# Altium project ALTAIR.PrjPcb (part 2 of 2)

## Sheet HDMI Termination.SchDoc
size A3; SheetNumber: 9; SheetTotal: 11
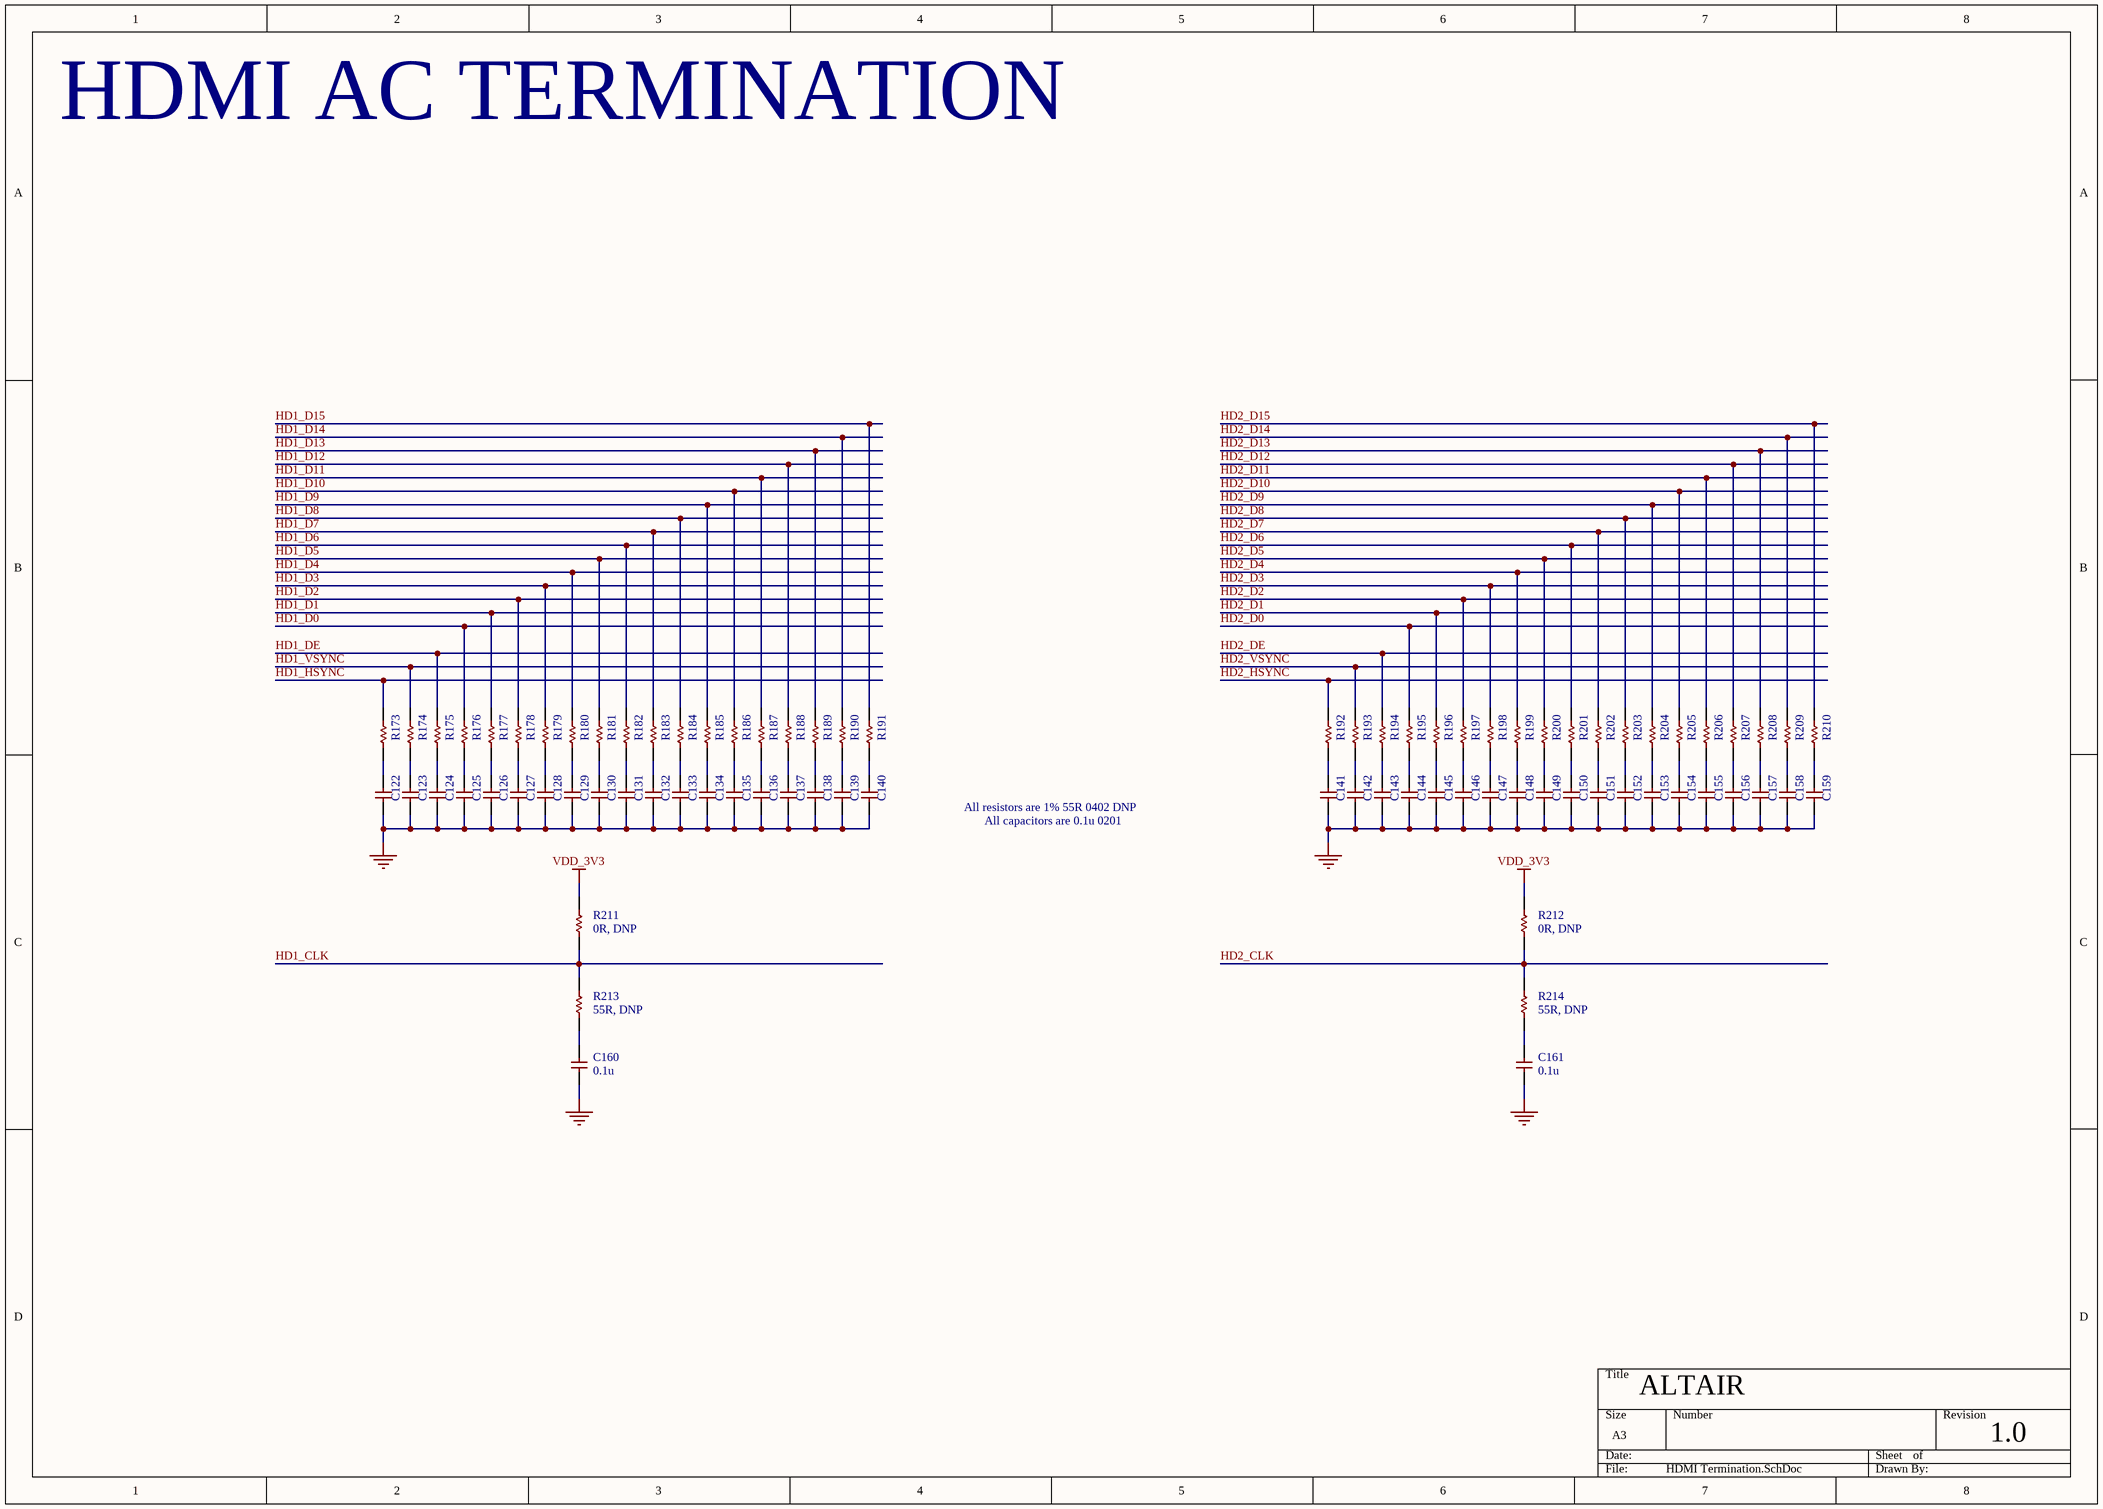
[diagram p8: HDMI Termination.SchDoc]

### Parts
C122  0.1u  [CAP_0201]  (value not drawn)
C123  0.1u  [CAP_0201]  (value not drawn)
C124  0.1u  [CAP_0201]  (value not drawn)
C125  0.1u  [CAP_0201]  (value not drawn)
C126  0.1u  [CAP_0201]  (value not drawn)
C127  0.1u  [CAP_0201]  (value not drawn)
C128  0.1u  [CAP_0201]  (value not drawn)
C129  0.1u  [CAP_0201]  (value not drawn)
C130  0.1u  [CAP_0201]  (value not drawn)
C131  0.1u  [CAP_0201]  (value not drawn)
C132  0.1u  [CAP_0201]  (value not drawn)
C133  0.1u  [CAP_0201]  (value not drawn)
C134  0.1u  [CAP_0201]  (value not drawn)
C135  0.1u  [CAP_0201]  (value not drawn)
C136  0.1u  [CAP_0201]  (value not drawn)
C137  0.1u  [CAP_0201]  (value not drawn)
C138  0.1u  [CAP_0201]  (value not drawn)
C139  0.1u  [CAP_0201]  (value not drawn)
C140  0.1u  [CAP_0201]  (value not drawn)
C141  0.1u  [CAP_0201]  (value not drawn)
C142  0.1u  [CAP_0201]  (value not drawn)
C143  0.1u  [CAP_0201]  (value not drawn)
C144  0.1u  [CAP_0201]  (value not drawn)
C145  0.1u  [CAP_0201]  (value not drawn)
C146  0.1u  [CAP_0201]  (value not drawn)
C147  0.1u  [CAP_0201]  (value not drawn)
C148  0.1u  [CAP_0201]  (value not drawn)
C149  0.1u  [CAP_0201]  (value not drawn)
C150  0.1u  [CAP_0201]  (value not drawn)
C151  0.1u  [CAP_0201]  (value not drawn)
C152  0.1u  [CAP_0201]  (value not drawn)
C153  0.1u  [CAP_0201]  (value not drawn)
C154  0.1u  [CAP_0201]  (value not drawn)
C155  0.1u  [CAP_0201]  (value not drawn)
C156  0.1u  [CAP_0201]  (value not drawn)
C157  0.1u  [CAP_0201]  (value not drawn)
C158  0.1u  [CAP_0201]  (value not drawn)
C159  0.1u  [CAP_0201]  (value not drawn)
C160  0.1u  [CAP_0201]
C161  0.1u  [CAP_0201]
R173  0R, DNP  [RES_0402]  (value not drawn)
R174  0R, DNP  [RES_0402]  (value not drawn)
R175  0R, DNP  [RES_0402]  (value not drawn)
R176  0R, DNP  [RES_0402]  (value not drawn)
R177  0R, DNP  [RES_0402]  (value not drawn)
R178  0R, DNP  [RES_0402]  (value not drawn)
R179  0R, DNP  [RES_0402]  (value not drawn)
R180  0R, DNP  [RES_0402]  (value not drawn)
R181  0R, DNP  [RES_0402]  (value not drawn)
R182  0R, DNP  [RES_0402]  (value not drawn)
R183  0R, DNP  [RES_0402]  (value not drawn)
R184  0R, DNP  [RES_0402]  (value not drawn)
R185  0R, DNP  [RES_0402]  (value not drawn)
R186  0R, DNP  [RES_0402]  (value not drawn)
R187  0R, DNP  [RES_0402]  (value not drawn)
R188  0R, DNP  [RES_0402]  (value not drawn)
R189  0R, DNP  [RES_0402]  (value not drawn)
R190  0R, DNP  [RES_0402]  (value not drawn)
R191  0R, DNP  [RES_0402]  (value not drawn)
R192  0R, DNP  [RES_0402]  (value not drawn)
R193  0R, DNP  [RES_0402]  (value not drawn)
R194  0R, DNP  [RES_0402]  (value not drawn)
R195  0R, DNP  [RES_0402]  (value not drawn)
R196  0R, DNP  [RES_0402]  (value not drawn)
R197  0R, DNP  [RES_0402]  (value not drawn)
R198  0R, DNP  [RES_0402]  (value not drawn)
R199  0R, DNP  [RES_0402]  (value not drawn)
R200  0R, DNP  [RES_0402]  (value not drawn)
R201  0R, DNP  [RES_0402]  (value not drawn)
R202  0R, DNP  [RES_0402]  (value not drawn)
R203  0R, DNP  [RES_0402]  (value not drawn)
R204  0R, DNP  [RES_0402]  (value not drawn)
R205  0R, DNP  [RES_0402]  (value not drawn)
R206  0R, DNP  [RES_0402]  (value not drawn)
R207  0R, DNP  [RES_0402]  (value not drawn)
R208  0R, DNP  [RES_0402]  (value not drawn)
R209  0R, DNP  [RES_0402]  (value not drawn)
R210  0R, DNP  [RES_0402]  (value not drawn)
R211  0R, DNP  [RES_0402]
R212  0R, DNP  [RES_0402]
R213  55R, DNP  [RES_0402]
R214  55R, DNP  [RES_0402]

### Nets
GND: C122.1 C123.1 C124.1 C125.1 C126.1 C127.1 C128.1 C129.1 C130.1 C131.1 C132.1 C133.1 C134.1 C135.1 C136.1 C137.1 C138.1 C139.1 C140.1 C141.1 C142.1 C143.1 C144.1 C145.1 C146.1 C147.1 C148.1 C149.1 C150.1 C151.1 C152.1 C153.1 C154.1 C155.1 C156.1 C157.1 C158.1 C159.1 C160.1 C161.1
VDD_3V3: R211.2 R212.2  [project net 3V3]
HD1_CLK: R211.1 R213.2
HD1_D0: R176.2
HD1_D1: R177.2
HD1_D2: R178.2
HD1_D3: R179.2
HD1_D4: R180.2
HD1_D5: R181.2
HD1_D6: R182.2
HD1_D7: R183.2
HD1_D8: R184.2
HD1_D9: R185.2
HD1_D10: R186.2
HD1_D11: R187.2
HD1_D12: R188.2
HD1_D13: R189.2
HD1_D14: R190.2
HD1_D15: R191.2
HD1_DE: R175.2
HD1_HSYNC: R173.2
HD1_VSYNC: R174.2
HD2_CLK: R212.1 R214.2
HD2_D0: R195.2
HD2_D1: R196.2
HD2_D2: R197.2
HD2_D3: R198.2
HD2_D4: R199.2
HD2_D5: R200.2
HD2_D6: R201.2
HD2_D7: R202.2
HD2_D8: R203.2
HD2_D9: R204.2
HD2_D10: R205.2
HD2_D11: R206.2
HD2_D12: R207.2
HD2_D13: R208.2
HD2_D14: R209.2
HD2_D15: R210.2
HD2_DE: R194.2
HD2_HSYNC: R192.2
HD2_VSYNC: R193.2
NetC122_2: C122.2 R173.1
NetC123_2: C123.2 R174.1
NetC124_2: C124.2 R175.1
NetC125_2: C125.2 R176.1
NetC126_2: C126.2 R177.1
NetC127_2: C127.2 R178.1
NetC128_2: C128.2 R179.1
NetC129_2: C129.2 R180.1
NetC130_2: C130.2 R181.1
NetC131_2: C131.2 R182.1
NetC132_2: C132.2 R183.1
NetC133_2: C133.2 R184.1
NetC134_2: C134.2 R185.1
NetC135_2: C135.2 R186.1
NetC136_2: C136.2 R187.1
NetC137_2: C137.2 R188.1
NetC138_2: C138.2 R189.1
NetC139_2: C139.2 R190.1
NetC140_2: C140.2 R191.1
NetC141_2: C141.2 R192.1
NetC142_2: C142.2 R193.1
NetC143_2: C143.2 R194.1
NetC144_2: C144.2 R195.1
NetC145_2: C145.2 R196.1
NetC146_2: C146.2 R197.1
NetC147_2: C147.2 R198.1
NetC148_2: C148.2 R199.1
NetC149_2: C149.2 R200.1
NetC150_2: C150.2 R201.1
NetC151_2: C151.2 R202.1
NetC152_2: C152.2 R203.1
NetC153_2: C153.2 R204.1
NetC154_2: C154.2 R205.1
NetC155_2: C155.2 R206.1
NetC156_2: C156.2 R207.1
NetC157_2: C157.2 R208.1
NetC158_2: C158.2 R209.1
NetC159_2: C159.2 R210.1
NetC160_2: C160.2 R213.1
NetC161_2: C161.2 R214.1

### Notes on the sheet
- HDMI AC TERMINATION
- All resistors are 1% 55R 0402 DNP
- All capacitors are 0.1u 0201
- ALTAIR
- 1.0

### Library data of the parts
C122-C161 = CAP_0201: Capacitor SMD 0201; Part No: CL03A104KP3NNNC; LCSC: *; JLCPCB Part #: C49062; Footprint JLCPCB: 0201
R173-R212 = RES_0402: as R6 on sheet Power; LCSC: *; Note/Misc: DNP; JLCPCB Part #: C60485; Footprint JLCPCB: 0402
R213 R214 = RES_0402: Resistor SMD 0402; LCSC: *; JLCPCB Part #: *; Footprint JLCPCB: *

## Sheet USB.SchDoc
size A3; SheetNumber: 10; SheetTotal: 11
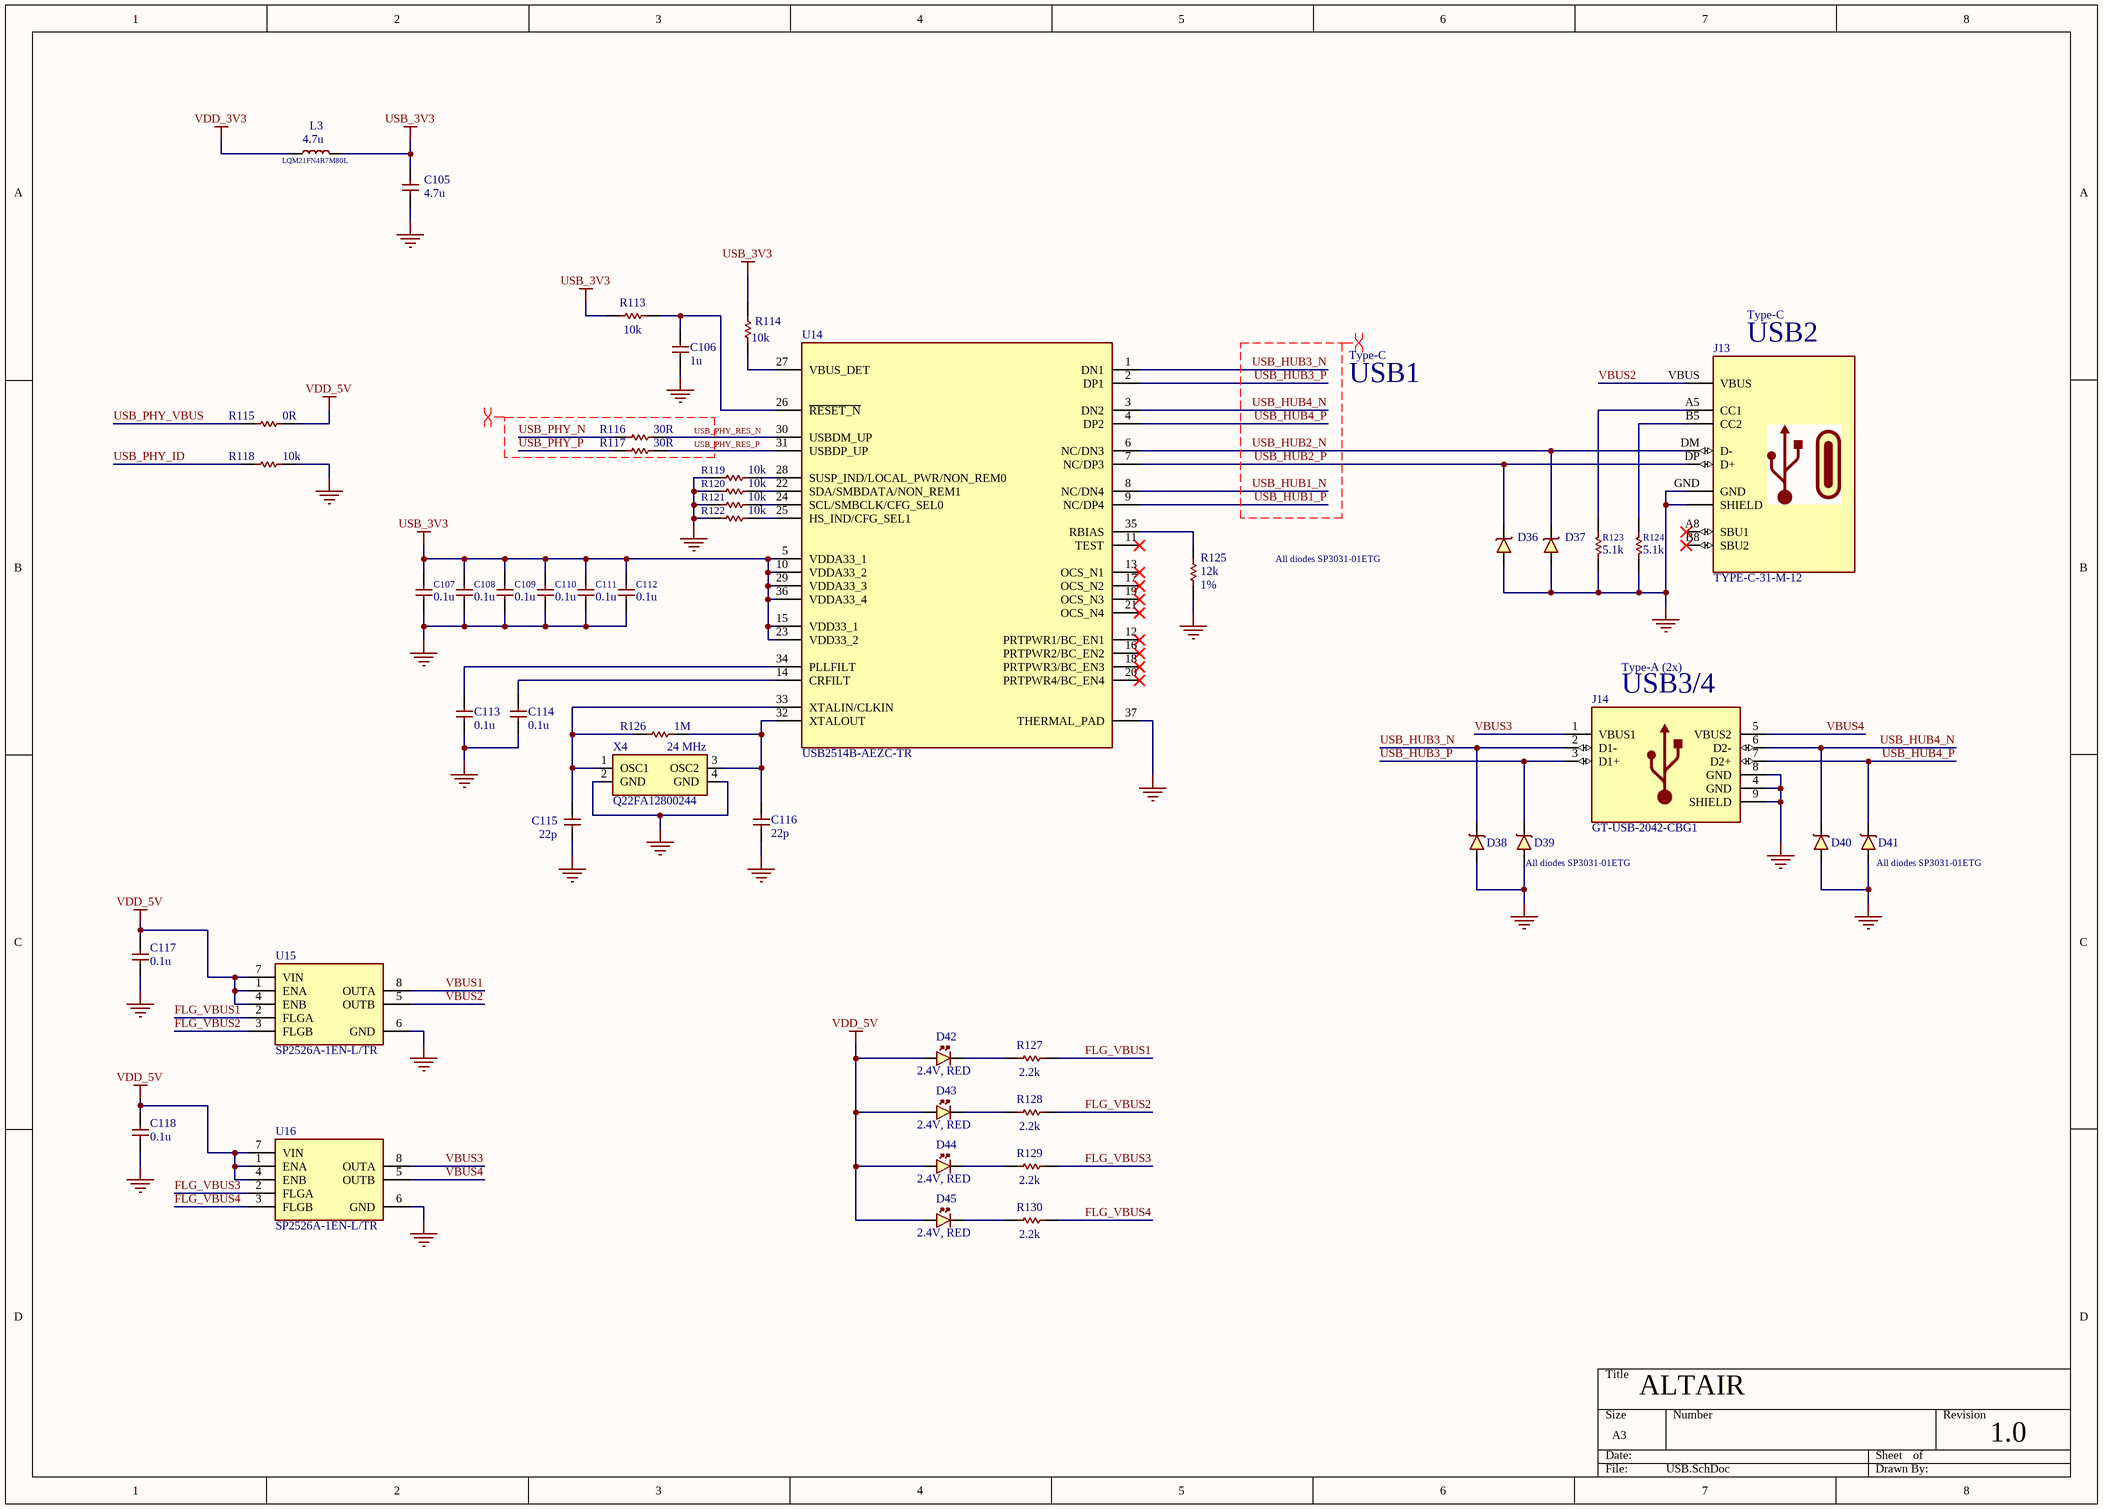
[diagram p9: USB.SchDoc]

### Parts
C105  4.7u  [CAP_0402]
C106  1u  [CAP_0402]
C107  0.1u  [CAP_0402]
C108  0.1u  [CAP_0402]
C109  0.1u  [CAP_0402]
C110  0.1u  [CAP_0402]
C111  0.1u  [CAP_0402]
C112  0.1u  [CAP_0402]
C113  0.1u  [CAP_0402]
C114  0.1u  [CAP_0402]
C115  22p  [CAP_0402]
C116  22p  [CAP_0402]
C117  0.1u  [CAP_0402]
C118  0.1u  [CAP_0402]
D36  SP3031-01ETG  [SP303101ETG]  (value not drawn)
D37  SP3031-01ETG  [SP303101ETG]  (value not drawn)
D38  SP3031-01ETG  [SP303101ETG]  (value not drawn)
D39  SP3031-01ETG  [SP303101ETG]  (value not drawn)
D40  SP3031-01ETG  [SP303101ETG]  (value not drawn)
D41  SP3031-01ETG  [SP303101ETG]  (value not drawn)
D42  Note/Misc: 2.4V, RED  [LED_0805_RED]  (hidden comment: RED)
D43  Note/Misc: 2.4V, RED  [LED_0805_RED]  (hidden comment: RED)
D44  Note/Misc: 2.4V, RED  [LED_0805_RED]  (hidden comment: RED)
D45  Note/Misc: 2.4V, RED  [LED_0805_RED]  (hidden comment: RED)
J13  TYPE-C-31-M-12  [HRO_TYPE-C-31-M-12]
J14  GT-USB-2042-CBG1  [GT-USB-2042-CBG1]
L3  4.7u  Note/Misc: LQM21FN4R7M80L  [INDC2012X145N]
R113  10k  [RES_0402]
R114  10k  [RES_0402]
R115  0R  [RES_0402]
R116  30R  [RES_0402]
R117  30R  [RES_0402]
R118  10k  [RES_0402]
R119  10k  [RES_0402]
R120  10k  [RES_0402]
R121  10k  [RES_0402]
R122  10k  [RES_0402]
R123  5.1k  [RES_0402]
R124  5.1k  [RES_0402]
R125  12k  Note/Misc: 1%  [RES_0402]
R126  1M  [RES_0402]
R127  2.2k  [RES_0402]
R128  2.2k  [RES_0402]
R129  2.2k  [RES_0402]
R130  2.2k  [RES_0402]
U14  USB2514B-AEZC-TR  [QFN50P600X600X100-37N-D]
U15  SP2526A-1EN-L/TR  [SOIC127P600X175-8N]
U16  SP2526A-1EN-L/TR  [SOIC127P600X175-8N]
X4  Note/Misc: 24 MHz  [Q22FA12800244]  (hidden comment: Q22FA12800244)

### Nets
GND: C105.1 C106.1 C107.1 C108.1 C109.1 C110.1 C111.1 C112.1 C113.1 C114.1 C115.1 C116.1 C117.1 C118.1 D36.2(A) D37.2(A) D38.2(A) D39.2(A) D40.2(A) D41.2(A) J13.GND J13.SHLD(SHIELD) J14.4(GND) J14.8(GND) J14.9(SHIELD) R118.2 R119.1 R120.1 R121.1 R122.1 R123.2 R124.2 R125.1 U14.37(THERMAL_PAD) U15.6(GND) U16.6(GND) X4.2(GND) X4.4(GND)
USB_3V3: C105.2 C107.2 C108.2 C109.2 C110.2 C111.2 C112.2 L3.2 R113.1 R114.1 U14.5(VDDA33_1) U14.10(VDDA33_2) U14.15(VDD33_1) U14.23(VDD33_2) U14.29(VDDA33_3) U14.36(VDDA33_4)
VDD_3V3: L3.1  [project net 3V3]
VDD_5V: C117.2 C118.2 D42.A D43.A D44.A D45.A R115.2 U15.1(ENA) U15.4(ENB) U15.7(VIN) U16.1(ENA) U16.4(ENB) U16.7(VIN)  [project net 5V]
FLG_VBUS1: R127.2 U15.2(FLGA)
FLG_VBUS2: R128.2 U15.3(FLGB)
FLG_VBUS3: R129.2 U16.2(FLGA)
FLG_VBUS4: R130.2 U16.3(FLGB)
USB_HUB1_N: U14.8(NC/DN4)
USB_HUB1_P: U14.9(NC/DP4)
USB_HUB2_N: D37.1(K) J13.DM(D-) U14.6(NC/DN3)
USB_HUB2_P: D36.1(K) J13.DP(D+) U14.7(NC/DP3)
USB_HUB3_N: D38.1(K) J14.2(D1-) U14.1(DN1)
USB_HUB3_P: D39.1(K) J14.3(D1+) U14.2(DP1)
USB_HUB4_N: D40.1(K) J14.6(D2-) U14.3(DN2)
USB_HUB4_P: D41.1(K) J14.7(D2+) U14.4(DP2)
USB_PHY_ID: R118.1
USB_PHY_N: R116.1
USB_PHY_P: R117.1
USB_PHY_RES_N: R116.2 U14.30(USBDM_UP)
USB_PHY_RES_P: R117.2 U14.31(USBDP_UP)
USB_PHY_VBUS: R115.1
VBUS1: U15.8(OUTA)
VBUS2: J13.VBUS U15.5(OUTB)
VBUS3: J14.1(VBUS1) U16.8(OUTA)
VBUS4: J14.5(VBUS2) U16.5(OUTB)
NetC106_2: C106.2 R113.2 U14.26(~{RESET_N})
NetC113_2: C113.2 U14.34(PLLFILT)
NetC114_2: C114.2 U14.14(CRFILT)
NetC115_2: C115.2 R126.2 U14.33(XTALIN/CLKIN) X4.1(OSC1)
NetC116_2: C116.2 R126.1 U14.32(XTALOUT) X4.3(OSC2)
NetD42_K: D42.K R127.1
NetD43_K: D43.K R128.1
NetD44_K: D44.K R129.1
NetD45_K: D45.K R130.1
NetJ13_A5: J13.A5(CC1) R123.1
NetJ13_B5: J13.B5(CC2) R124.1
NetR114_2: R114.2 U14.27(VBUS_DET)
NetR119_2: R119.2 U14.28(SUSP_IND/LOCAL_PWR/NON_REM0)
NetR120_2: R120.2 U14.22(SDA/SMBDATA/NON_REM1)
NetR121_2: R121.2 U14.24(SCL/SMBCLK/CFG_SEL0)
NetR122_2: R122.2 U14.25(HS_IND/CFG_SEL1)
NetR125_2: R125.2 U14.35(RBIAS)

Not connected (* = marked no-connect by the designer): J13 A8(SBU1)* B8(SBU2)*; U14 11(TEST)* 12(PRTPWR1/BC_EN1)* 13(OCS_N1)* 16(PRTPWR2/BC_EN2)* 17(OCS_N2)* 18(PRTPWR3/BC_EN3)* 19(OCS_N3)* 20(PRTPWR4/BC_EN4)* 21(OCS_N4)*

### Layout directives
differential pair: USB_HUB1_N, USB_HUB1_P, USB_HUB2_N, USB_HUB2_P, USB_HUB3_N, USB_HUB3_P, USB_HUB4_N, USB_HUB4_P, USB_PHY_N, USB_PHY_P, USB_PHY_RES_N, USB_PHY_RES_P

### Notes on the sheet
- Type-C
- (near J13) USB2
- USB1
- (near D36) All diodes SP3031-01ETG
- (near J14) USB3/4
- Type-A (2x)
- (near D39) All diodes SP3031-01ETG
- (near D41) All diodes SP3031-01ETG
- ALTAIR
- 1.0

### Library data of the parts
C105 = CAP_0402: Capacitor SMD 0402; Part No: HGC0402R5475M250NTEJ; LCSC: *; JLCPCB Part #: C22367824; Footprint JLCPCB: 0402
C106 = CAP_0402: Capacitor SMD 0402; Part No: CL05A105KP5NNNC; Note/Misc: 10V; LCSC: *; JLCPCB Part #: C14445; Footprint JLCPCB: 0402
C107-C114 C117 C118 = CAP_0402: as C13 on sheet SD & Boot; LCSC: *; JLCPCB Part #: C338112; Footprint JLCPCB: 0402
C115 C116 = CAP_0402: Capacitor SMD 0402; Part No: CC0402JRNPO8BN220; LCSC: *; JLCPCB Part #: C541361; Footprint JLCPCB: 0402
D36-D41 = SP3031-01ETG: TVS Diode (Uni-directional); Footprint JLCPCB: SOD-882; JLCPCB Part #: C207283; LCSC: *; Note/Misc: *; Part No: SP3031-01ETG
D42-D45 = LED_0805_RED: LED 0805 RED SMD; Part No: HL-PSC-2012S9AC; LCSC: *; Footprint JLCPCB: 0805; JLCPCB Part #: C497952
J13 = TYPE-C-31-M-12: USB2.0, Type C, Top mount, CH 1.68mm, Dual Row SMT; LCSC: *; Note/Misc: *; Part No: TYPE-C-31-M-12; JLCPCB Part #: C165948; Footprint JLCPCB: SMD
J14 = GT-USB-2042-CBG1: 2x USB Type-A Female Connector; LCSC: *; Note/Misc: *; Part No: GT-USB-2042-CBG1; JLCPCB Part #: C2911522; Footprint JLCPCB: Plugin
L3 = LQM21FN4R7M70L: Inductor; LCSC: *; Part No: LQM21FN4R7M80L; JLCPCB Part #: C464406; Footprint JLCPCB: 0805
R113 R114 R118-R122 = RES_0402: Resistor SMD 0402; Part No: RC0402JR-0710KL; LCSC: *; JLCPCB Part #: C60489; Footprint JLCPCB: 0402
R115 = RES_0402: as R6 on sheet Power; LCSC: *; JLCPCB Part #: C60485; Footprint JLCPCB: 0402
R116 R117 = RES_0402: Resistor SMD 0402; Part No: RC0402FR-0730RL; Note/Misc: 1%; LCSC: *; JLCPCB Part #: C138007; Footprint JLCPCB: 0402
R123 R124 = RES_0402: Resistor SMD 0402; Part No: RC0402JR-075K1L; LCSC: *; JLCPCB Part #: C105873; Footprint JLCPCB: 0402
R125 = RES_0402: Resistor SMD 0402; Part No: RC0402FR-0712KL; LCSC: *; JLCPCB Part #: C114760; Footprint JLCPCB: 0402
R126 = RES_0402: Resistor SMD 0402; Part No: RC0402JR-071ML; LCSC: *; JLCPCB Part #: C93949; Footprint JLCPCB: 0402
R127-R130 = RES_0402: Resistor SMD 0402; Part No: RC0402JR-072K2L; LCSC: *; JLCPCB Part #: C163447; Footprint JLCPCB: 0402
U14 = USB2514B-AEZC-TR: USB Hub; LCSC: *; Note/Misc: *; Part No: USB2514B-AEZC-TR; JLCPCB Part #: C16251; Footprint JLCPCB: VQFN-36-EP(6x6)
X4 = Q22FA12800244: 24 MHz Crystal SMD 4-Pin 2.0x1.6mm 4 Pins Alt; JLCPCB Part #: C255880; LCSC: *; Footprint JLCPCB: SMD2016-4P; Part No: Q22FA12800244
U15 U16 = SP2526A-1EN-L/TR: LCSC: *; Note/Misc: *; Part No: SP2526A-1EN-L/TR; JLCPCB Part #: C37347; Footprint JLCPCB: SOIC-8

## Sheet Ethernet & PMOD.SchDoc
size A3; SheetNumber: 11; SheetTotal: 11
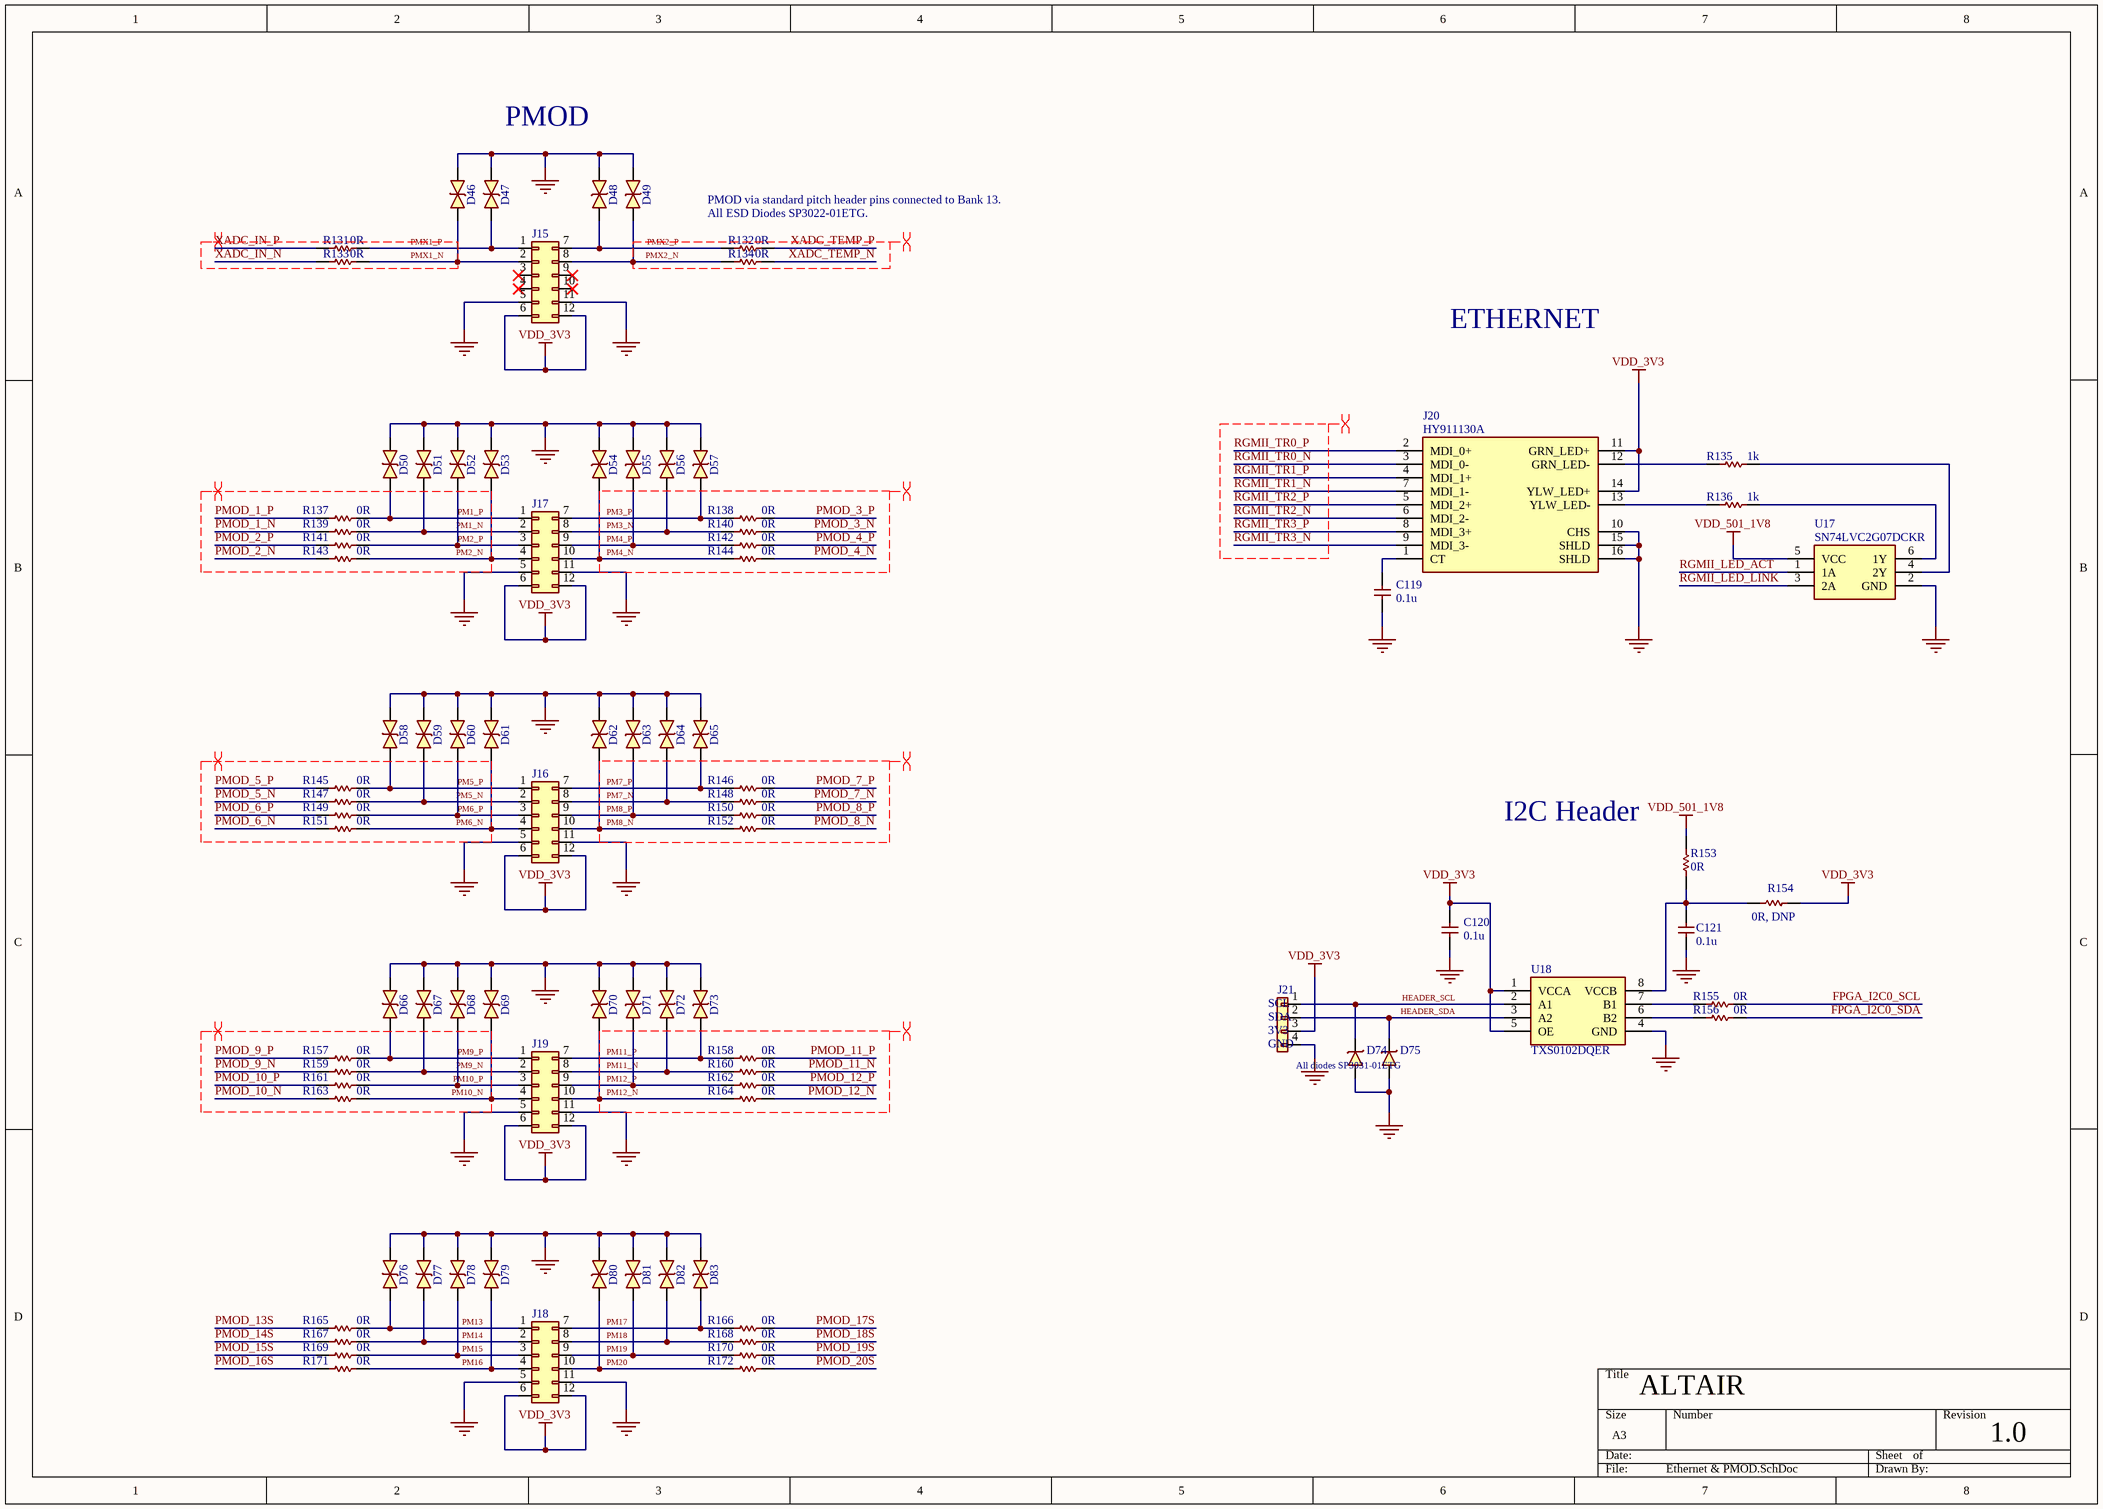
[diagram p10: Ethernet & PMOD.SchDoc]

### Parts
C119  0.1u  [CAP_0402]
C120  0.1u  [CAP_0402]
C121  0.1u  [CAP_0402]
D46  SP3022-01ETG  [SP302201ETGNM]  (value not drawn)
D47  SP3022-01ETG  [SP302201ETGNM]  (value not drawn)
D48  SP3022-01ETG  [SP302201ETGNM]  (value not drawn)
D49  SP3022-01ETG  [SP302201ETGNM]  (value not drawn)
D50  SP3022-01ETG  [SP302201ETGNM]  (value not drawn)
D51  SP3022-01ETG  [SP302201ETGNM]  (value not drawn)
D52  SP3022-01ETG  [SP302201ETGNM]  (value not drawn)
D53  SP3022-01ETG  [SP302201ETGNM]  (value not drawn)
D54  SP3022-01ETG  [SP302201ETGNM]  (value not drawn)
D55  SP3022-01ETG  [SP302201ETGNM]  (value not drawn)
D56  SP3022-01ETG  [SP302201ETGNM]  (value not drawn)
D57  SP3022-01ETG  [SP302201ETGNM]  (value not drawn)
D58  SP3022-01ETG  [SP302201ETGNM]  (value not drawn)
D59  SP3022-01ETG  [SP302201ETGNM]  (value not drawn)
D60  SP3022-01ETG  [SP302201ETGNM]  (value not drawn)
D61  SP3022-01ETG  [SP302201ETGNM]  (value not drawn)
D62  SP3022-01ETG  [SP302201ETGNM]  (value not drawn)
D63  SP3022-01ETG  [SP302201ETGNM]  (value not drawn)
D64  SP3022-01ETG  [SP302201ETGNM]  (value not drawn)
D65  SP3022-01ETG  [SP302201ETGNM]  (value not drawn)
D66  SP3022-01ETG  [SP302201ETGNM]  (value not drawn)
D67  SP3022-01ETG  [SP302201ETGNM]  (value not drawn)
D68  SP3022-01ETG  [SP302201ETGNM]  (value not drawn)
D69  SP3022-01ETG  [SP302201ETGNM]  (value not drawn)
D70  SP3022-01ETG  [SP302201ETGNM]  (value not drawn)
D71  SP3022-01ETG  [SP302201ETGNM]  (value not drawn)
D72  SP3022-01ETG  [SP302201ETGNM]  (value not drawn)
D73  SP3022-01ETG  [SP302201ETGNM]  (value not drawn)
D74  SP3031-01ETG  [SP303101ETG]  (value not drawn)
D75  SP3031-01ETG  [SP303101ETG]  (value not drawn)
D76  SP3022-01ETG  [SP302201ETGNM]  (value not drawn)
D77  SP3022-01ETG  [SP302201ETGNM]  (value not drawn)
D78  SP3022-01ETG  [SP302201ETGNM]  (value not drawn)
D79  SP3022-01ETG  [SP302201ETGNM]  (value not drawn)
D80  SP3022-01ETG  [SP302201ETGNM]  (value not drawn)
D81  SP3022-01ETG  [SP302201ETGNM]  (value not drawn)
D82  SP3022-01ETG  [SP302201ETGNM]  (value not drawn)
D83  SP3022-01ETG  [SP302201ETGNM]  (value not drawn)
J15  PMOD_HEADER  [PMOD_HEADER]  (value not drawn)
J16  PMOD_HEADER  [PMOD_HEADER]  (value not drawn)
J17  PMOD_HEADER  [PMOD_HEADER]  (value not drawn)
J18  PMOD_HEADER  [PMOD_HEADER]  (value not drawn)
J19  PMOD_HEADER  [PMOD_HEADER]  (value not drawn)
J20  HY911130A  [HY911130A]
J21  4xHeader  [HDRV4W95P0X254_1X4_1016X254X854P]  (value not drawn)
R131  0R  [RES_0402]
R132  0R  [RES_0402]
R133  0R  [RES_0402]
R134  0R  [RES_0402]
R135  1k  [RES_0402]
R136  1k  [RES_0402]
R137  0R  [RES_0402]
R138  0R  [RES_0402]
R139  0R  [RES_0402]
R140  0R  [RES_0402]
R141  0R  [RES_0402]
R142  0R  [RES_0402]
R143  0R  [RES_0402]
R144  0R  [RES_0402]
R145  0R  [RES_0402]
R146  0R  [RES_0402]
R147  0R  [RES_0402]
R148  0R  [RES_0402]
R149  0R  [RES_0402]
R150  0R  [RES_0402]
R151  0R  [RES_0402]
R152  0R  [RES_0402]
R153  0R  [RES_0402]
R154  0R, DNP  [RES_0402]
R155  0R  [RES_0402]
R156  0R  [RES_0402]
R157  0R  [RES_0402]
R158  0R  [RES_0402]
R159  0R  [RES_0402]
R160  0R  [RES_0402]
R161  0R  [RES_0402]
R162  0R  [RES_0402]
R163  0R  [RES_0402]
R164  0R  [RES_0402]
R165  0R  [RES_0402]
R166  0R  [RES_0402]
R167  0R  [RES_0402]
R168  0R  [RES_0402]
R169  0R  [RES_0402]
R170  0R  [RES_0402]
R171  0R  [RES_0402]
R172  0R  [RES_0402]
U17  SN74LVC2G07DCKR  [SOT65P210X110-6N]
U18  TXS0102DQER  [SON35P100X140X40-8N]

### Nets
GND: C119.1 C120.1 C121.1 D46.1 D47.1 D48.1 D49.1 D50.1 D51.1 D52.1 D53.1 D54.1 D55.1 D56.1 D57.1 D58.1 D59.1 D60.1 D61.1 D62.1 D63.1 D64.1 D65.1 D66.1 D67.1 D68.1 D69.1 D70.1 D71.1 D72.1 D73.1 D74.2(A) D75.2(A) D76.1 D77.1 D78.1 D79.1 D80.1 D81.1 D82.1 D83.1 J15.5 J15.11 J16.5 J16.11 J17.5 J17.11 J18.5 J18.11 J19.5 J19.11 J20.10(CHS) J20.15(SHLD) J20.16(SHLD) J21.4 U17.2(GND) U18.4(GND)
VDD_3V3: C120.2 J15.6 J15.12 J16.6 J16.12 J17.6 J17.12 J18.6 J18.12 J19.6 J19.12 J20.11(GRN_LED+) J20.14(YLW_LED+) J21.3 R154.2 U18.1(VCCA) U18.5(OE)  [project net 3V3]
VDD_501_1V8: R153.2 U17.5(VCC)
FPGA_I2C0_SCL: R155.2
FPGA_I2C0_SDA: R156.2
HEADER_SCL: D74.1(K) J21.1 U18.2(A1)
HEADER_SDA: D75.1(K) J21.2 U18.3(A2)
PM1_N: D51.2 J17.2 R139.2
PM1_P: D50.2 J17.1 R137.2
PM2_N: D53.2 J17.4 R143.2
PM2_P: D52.2 J17.3 R141.2
PM3_N: D56.2 J17.8 R140.1
PM3_P: D57.2 J17.7 R138.1
PM4_N: D54.2 J17.10 R144.1
PM4_P: D55.2 J17.9 R142.1
PM5_N: D59.2 J16.2 R147.2
PM5_P: D58.2 J16.1 R145.2
PM6_N: D61.2 J16.4 R151.2
PM6_P: D60.2 J16.3 R149.2
PM7_N: D64.2 J16.8 R148.1
PM7_P: D65.2 J16.7 R146.1
PM8_N: D62.2 J16.10 R152.1
PM8_P: D63.2 J16.9 R150.1
PM9_N: D67.2 J19.2 R159.2
PM9_P: D66.2 J19.1 R157.2
PM10_N: D69.2 J19.4 R163.2
PM10_P: D68.2 J19.3 R161.2
PM11_N: D72.2 J19.8 R160.1
PM11_P: D73.2 J19.7 R158.1
PM12_N: D70.2 J19.10 R164.1
PM12_P: D71.2 J19.9 R162.1
PM13: D76.2 J18.1 R165.2
PM14: D77.2 J18.2 R167.2
PM15: D78.2 J18.3 R169.2
PM16: D79.2 J18.4 R171.2
PM17: D83.2 J18.7 R166.1
PM18: D82.2 J18.8 R168.1
PM19: D81.2 J18.9 R170.1
PM20: D80.2 J18.10 R172.1
PMOD_1_N: R139.1
PMOD_1_P: R137.1
PMOD_2_N: R143.1
PMOD_2_P: R141.1
PMOD_3_N: R140.2
PMOD_3_P: R138.2
PMOD_4_N: R144.2
PMOD_4_P: R142.2
PMOD_5_N: R147.1
PMOD_5_P: R145.1
PMOD_6_N: R151.1
PMOD_6_P: R149.1
PMOD_7_N: R148.2
PMOD_7_P: R146.2
PMOD_8_N: R152.2
PMOD_8_P: R150.2
PMOD_9_N: R159.1
PMOD_9_P: R157.1
PMOD_10_N: R163.1
PMOD_10_P: R161.1
PMOD_11_N: R160.2
PMOD_11_P: R158.2
PMOD_12_N: R164.2
PMOD_12_P: R162.2
PMOD_13S: R165.1
PMOD_14S: R167.1
PMOD_15S: R169.1
PMOD_16S: R171.1
PMOD_17S: R166.2
PMOD_18S: R168.2
PMOD_19S: R170.2
PMOD_20S: R172.2
PMX1_N: D46.2 J15.2 R133.2
PMX1_P: D47.2 J15.1 R131.2
PMX2_N: D49.2 J15.8 R134.1
PMX2_P: D48.2 J15.7 R132.1
RGMII_LED_ACT: U17.1(1A)
RGMII_LED_LINK: U17.3(2A)
RGMII_TR0_N: J20.3(MDI_0-)
RGMII_TR0_P: J20.2(MDI_0+)
RGMII_TR1_N: J20.7(MDI_1-)
RGMII_TR1_P: J20.4(MDI_1+)
RGMII_TR2_N: J20.6(MDI_2-)
RGMII_TR2_P: J20.5(MDI_2+)
RGMII_TR3_N: J20.9(MDI_3-)
RGMII_TR3_P: J20.8(MDI_3+)
XADC_IN_N: R133.1
XADC_IN_P: R131.1
XADC_TEMP_N: R134.2
XADC_TEMP_P: R132.2
NetC119_2: C119.2 J20.1(CT)
NetC121_2: C121.2 R153.1 R154.1 U18.8(VCCB)
NetJ20_12: J20.12(GRN_LED-) R135.1
NetJ20_13: J20.13(YLW_LED-) R136.1
NetR135_2: R135.2 U17.4(2Y)
NetR136_2: R136.2 U17.6(1Y)
NetR155_1: R155.1 U18.7(B1)
NetR156_1: R156.1 U18.6(B2)

Not connected (* = marked no-connect by the designer): J15 3* 4* 9* 10*

### Layout directives
differential pair: PM1_N, PM1_P, PM2_N, PM2_P, PM3_N, PM3_P, PM4_N, PM4_P, PM5_N, PM5_P, PM6_N, PM6_P, PM7_N, PM7_P, PM8_N, PM8_P, PM9_N, PM9_P, PM10_N, PM10_P, PM11_N, PM11_P, PM12_N, PM12_P, PMOD_1_N, PMOD_1_P, PMOD_2_N, PMOD_2_P, PMOD_3_N, PMOD_3_P, PMOD_4_N, PMOD_4_P, PMOD_5_N, PMOD_5_P, PMOD_6_N, PMOD_6_P, PMOD_7_N, PMOD_7_P, PMOD_8_N, PMOD_8_P, PMOD_9_N, PMOD_9_P, PMOD_10_N, PMOD_10_P, PMOD_11_N, PMOD_11_P, PMOD_12_N, PMOD_12_P, PMX1_N, PMX1_P, PMX2_N, PMX2_P, RGMII_TR0_N, RGMII_TR0_P, RGMII_TR1_N, RGMII_TR1_P, RGMII_TR2_N, RGMII_TR2_P, RGMII_TR3_N, RGMII_TR3_P, XADC_IN_N, XADC_IN_P, XADC_TEMP_N, XADC_TEMP_P

### Notes on the sheet
- PMOD
- PMOD via standard pitch header pins connected to Bank 13.
- All ESD Diodes SP3022-01ETG.
- ETHERNET
- (near R153) I2C Header
- (near J21) SCL
- (near J21) 3V3
- (near J21) SDA
- (near J21) GND
- (near D75) All diodes SP3031-01ETG
- ALTAIR
- 1.0

### Library data of the parts
C119-C121 = CAP_0402: Capacitor SMD 0402; Part No: CL05B104KO5NNNC; Note/Misc: 16V, 0402; LCSC: *; JLCPCB Part #: C338112; Footprint JLCPCB: 0402
D46-D73 D76-D83 = SP3022-01ETG: TVS Diode (Bi-directional); Footprint JLCPCB: SOD-882; JLCPCB Part #: C126840; Part No: SP3022-01ETG
D74 D75 = SP3031-01ETG: TVS Diode (Uni-directional); Footprint JLCPCB: SOD-882; JLCPCB Part #: C207283; LCSC: *; Note/Misc: *; Part No: SP3031-01ETG
J15-J17 J19 = PMOD_HEADER: NON-Standard 2x6 pin 2.54mm pitch connector. Right Angle; Part No: HC-PM254-8.5H-2x6PW; Footprint JLCPCB: Push-Pull,P=2.54mm; JLCPCB Part #: C22373932
J18 = PMOD_HEADER: NON-Standard 2x6 pin 2.54mm pitch connector. Right Angle
J20 = HY911130A: Ethernet Connector; LCSC: *; Note/Misc: *; Part No: HY911130A; JLCPCB Part #: C55679; Footprint JLCPCB: Plugin
J21 = 4xHeader: Standard 4 pin 2.54mm pitch connector; Part No: X6511WV-04H-C60D30; Footprint JLCPCB: Plugin,P=2.54mm; JLCPCB Part #: C706876
R131-R134 R137-R172 = RES_0402: Resistor SMD 0402; Part No: RC0402JR-070RL; LCSC: *; JLCPCB Part #: C60485; Footprint JLCPCB: 0402
  R154: Note/Misc: DNP
R135 R136 = RES_0402: Resistor SMD 0402; Part No: RC0402JR-071KL; LCSC: *; JLCPCB Part #: C105637; Footprint JLCPCB: 0402
U17 = SN74LVC2G07DCKR: Buffer Gate 1 input 1 output; Footprint JLCPCB: SC-70-6; JLCPCB Part #: C7849; Part No: SN74LVC2G07DCKR
U18 = TXS0102DQER: I2C UART Voltage Level Translator; LCSC: *; Note/Misc: *; Part No: TXS0102DQER; JLCPCB Part #: C2652935; Footprint JLCPCB: X2-SON-8(1x1.4)

## Nets that join several sheets
3V3: Power (9 pins), SD & Boot (11 pins), FTDI (38 pins), MIPI (6 pins), HDMI1 (11 pins), HDMI2 (9 pins), HDMI Termination (R211.2 R212.2), USB (L3.1), Ethernet & PMOD (17 pins)
5V: BTB Mezzanine (8 pins), Power (5 pins), HDMI1 (C45.2 J11.18 R90.2 R91.2), HDMI2 (C77.2 J12.18 R103.2 R104.2), USB (13 pins)
GND: BTB Mezzanine (50 pins), Power (28 pins), SD & Boot (31 pins), FTDI (61 pins), MIPI (12 pins), HDMI1 (99 pins), HDMI2 (92 pins), HDMI Termination (40 pins), USB (38 pins), Ethernet & PMOD (57 pins)
HDMI_1V8: HDMI1 (6 pins), HDMI2 (FB11.2 FB13.2 FB14.2 FB15.2)
VDD_13_3V3: BTB Mezzanine (J3.81 J3.82), Power (FB1.2)
VDD_34_3V3: BTB Mezzanine (J3.35 J3.36), Power (FB2.2)
VDD_35_3V3: BTB Mezzanine (J2.59 J2.60), Power (FB3.2)
VDD_500_3V3: BTB Mezzanine (J2.139), SD & Boot (6 pins)
VDD_501_1V8: BTB Mezzanine (J2.138), SD & Boot (C11.2 R17.1 R24.1 U3.5), MIPI (R67.2 R68.2 R71.1 R72.1), Ethernet & PMOD (R153.2 U17.5)
3V3_PG: Power (R7.1 U2.4), SD & Boot (U4.2 U4.6)
BOOT_MODE0: BTB Mezzanine (J2.109), SD & Boot (R21.2)
BOOT_MODE2: BTB Mezzanine (J2.111), SD & Boot (R22.2)
FPGA_I2C0_SCL: BTB Mezzanine (J2.126), Ethernet & PMOD (R155.2)
FPGA_I2C0_SDA: BTB Mezzanine (J2.128), Ethernet & PMOD (R156.2)
FPGA_I2C1_SCL: BTB Mezzanine (J2.122), MIPI (R71.2 U10.1)
FPGA_I2C1_SDA: BTB Mezzanine (J2.124), MIPI (R72.2 U10.2)
HD1_CLK: BTB Mezzanine (J2.64), HDMI1 (U11.79), HDMI Termination (R211.1 R213.2)
HD1_D0: BTB Mezzanine (J2.34), HDMI1 (U11.88), HDMI Termination (R176.2)
HD1_D1: BTB Mezzanine (J2.36), HDMI1 (U11.87), HDMI Termination (R177.2)
HD1_D2: BTB Mezzanine (J2.38), HDMI1 (U11.86), HDMI Termination (R178.2)
HD1_D3: BTB Mezzanine (J2.40), HDMI1 (U11.85), HDMI Termination (R179.2)
HD1_D4: BTB Mezzanine (J2.42), HDMI1 (U11.84), HDMI Termination (R180.2)
HD1_D5: BTB Mezzanine (J2.44), HDMI1 (U11.83), HDMI Termination (R181.2)
HD1_D6: BTB Mezzanine (J2.48), HDMI1 (U11.82), HDMI Termination (R182.2)
HD1_D7: BTB Mezzanine (J2.50), HDMI1 (U11.81), HDMI Termination (R183.2)
HD1_D8: BTB Mezzanine (J2.52), HDMI1 (U11.80), HDMI Termination (R184.2)
HD1_D9: BTB Mezzanine (J2.54), HDMI1 (U11.78), HDMI Termination (R185.2)
HD1_D10: BTB Mezzanine (J2.56), HDMI1 (U11.74), HDMI Termination (R186.2)
HD1_D11: BTB Mezzanine (J2.58), HDMI1 (U11.73), HDMI Termination (R187.2)
HD1_D12: BTB Mezzanine (J2.68), HDMI1 (U11.72), HDMI Termination (R188.2)
HD1_D13: BTB Mezzanine (J2.70), HDMI1 (U11.71), HDMI Termination (R189.2)
HD1_D14: BTB Mezzanine (J2.72), HDMI1 (U11.70), HDMI Termination (R190.2)
HD1_D15: BTB Mezzanine (J2.74), HDMI1 (U11.69), HDMI Termination (R191.2)
HD1_DE: BTB Mezzanine (J2.39), HDMI1 (U11.97), HDMI Termination (R175.2)
HD1_HSYNC: BTB Mezzanine (J2.35), HDMI1 (U11.98), HDMI Termination (R173.2)
HD1_INT: BTB Mezzanine (J2.78), HDMI1 (R97.1 U11.45)
HD1_SCL: BTB Mezzanine (J2.84), HDMI1 (R96.1 U11.55)
HD1_SDA: BTB Mezzanine (J2.82), HDMI1 (R95.1 U11.56)
HD1_SPDIF: BTB Mezzanine (J2.66), HDMI1 (R93.2)
HD1_SPDIFO: BTB Mezzanine (J2.80), HDMI1 (R94.2)
HD1_VSYNC: BTB Mezzanine (J2.31), HDMI1 (U11.2), HDMI Termination (R174.2)
HD2_CLK: BTB Mezzanine (J3.97), HDMI2 (U13.79), HDMI Termination (R212.1 R214.2)
HD2_D0: BTB Mezzanine (J3.86), HDMI2 (U13.88), HDMI Termination (R195.2)
HD2_D1: BTB Mezzanine (J3.88), HDMI2 (U13.87), HDMI Termination (R196.2)
HD2_D2: BTB Mezzanine (J3.90), HDMI2 (U13.86), HDMI Termination (R197.2)
HD2_D3: BTB Mezzanine (J3.92), HDMI2 (U13.85), HDMI Termination (R198.2)
HD2_D4: BTB Mezzanine (J3.94), HDMI2 (U13.84), HDMI Termination (R199.2)
HD2_D5: BTB Mezzanine (J3.96), HDMI2 (U13.83), HDMI Termination (R200.2)
HD2_D6: BTB Mezzanine (J3.100), HDMI2 (U13.82), HDMI Termination (R201.2)
HD2_D7: BTB Mezzanine (J3.102), HDMI2 (U13.81), HDMI Termination (R202.2)
HD2_D8: BTB Mezzanine (J3.104), HDMI2 (U13.80), HDMI Termination (R203.2)
HD2_D9: BTB Mezzanine (J3.106), HDMI2 (U13.78), HDMI Termination (R204.2)
HD2_D10: BTB Mezzanine (J3.108), HDMI2 (U13.74), HDMI Termination (R205.2)
HD2_D11: BTB Mezzanine (J3.110), HDMI2 (U13.73), HDMI Termination (R206.2)
HD2_D12: BTB Mezzanine (J3.101), HDMI2 (U13.72), HDMI Termination (R207.2)
HD2_D13: BTB Mezzanine (J3.103), HDMI2 (U13.71), HDMI Termination (R208.2)
HD2_D14: BTB Mezzanine (J3.105), HDMI2 (U13.70), HDMI Termination (R209.2)
HD2_D15: BTB Mezzanine (J3.107), HDMI2 (U13.69), HDMI Termination (R210.2)
HD2_DE: BTB Mezzanine (J3.91), HDMI2 (U13.97), HDMI Termination (R194.2)
HD2_HSYNC: BTB Mezzanine (J3.87), HDMI2 (U13.98), HDMI Termination (R192.2)
HD2_INT: BTB Mezzanine (J3.85), HDMI2 (R110.1 U13.45)
HD2_SCL: BTB Mezzanine (J2.87), HDMI2 (R109.1 U13.55)
HD2_SDA: BTB Mezzanine (J2.89), HDMI2 (R108.1 U13.56)
HD2_SPDIF: BTB Mezzanine (J2.86), HDMI2 (R106.2)
HD2_SPDIFO: BTB Mezzanine (J2.88), HDMI2 (R107.2)
HD2_VSYNC: BTB Mezzanine (J3.83), HDMI2 (U13.2), HDMI Termination (R193.2)
LP_MIPI1_CSI_C_N: BTB Mezzanine (J3.26), MIPI (R77.1)
LP_MIPI1_CSI_C_P: BTB Mezzanine (J3.24), MIPI (R66.1)
LP_MIPI1_CSI_L0_N: BTB Mezzanine (J3.50), MIPI (R61.1)
LP_MIPI1_CSI_L0_P: BTB Mezzanine (J3.48), MIPI (R59.1)
LP_MIPI1_CSI_L1_N: BTB Mezzanine (J3.34), MIPI (R64.1)
LP_MIPI1_CSI_L1_P: BTB Mezzanine (J3.32), MIPI (R62.1)
LP_MIPI2_CSI_C_N: BTB Mezzanine (J3.15), MIPI (R86.1)
LP_MIPI2_CSI_C_P: BTB Mezzanine (J3.13), MIPI (R84.1)
LP_MIPI2_CSI_L0_N: BTB Mezzanine (J3.16), MIPI (R80.1)
LP_MIPI2_CSI_L0_P: BTB Mezzanine (J3.14), MIPI (R78.1)
LP_MIPI2_CSI_L1_N: BTB Mezzanine (J3.29), MIPI (R83.1)
LP_MIPI2_CSI_L1_P: BTB Mezzanine (J3.27), MIPI (R81.1)
MIPI1_CSI_C_N: BTB Mezzanine (J3.30), MIPI (J9.8 R69.2 R77.2)
MIPI1_CSI_C_P: BTB Mezzanine (J3.28), MIPI (J9.9 R66.2 R69.1)
MIPI1_CSI_L0_N: BTB Mezzanine (J3.46), MIPI (J9.2 R60.2 R61.2)
MIPI1_CSI_L0_P: BTB Mezzanine (J3.44), MIPI (J9.3 R59.2 R60.1)
MIPI1_CSI_L1_N: BTB Mezzanine (J3.42), MIPI (J9.5 R63.2 R64.2)
MIPI1_CSI_L1_P: BTB Mezzanine (J3.40), MIPI (J9.6 R62.2 R63.1)
MIPI1_GPIO0: BTB Mezzanine (J3.12), MIPI (J9.11)
MIPI1_GPIO1: BTB Mezzanine (J3.10), MIPI (J9.12)
MIPI2_CSI_C_N: BTB Mezzanine (J3.11), MIPI (J10.8 R85.2 R86.2)
MIPI2_CSI_C_P: BTB Mezzanine (J3.9), MIPI (J10.9 R84.2 R85.1)
MIPI2_CSI_L0_N: BTB Mezzanine (J3.20), MIPI (J10.2 R79.2 R80.2)
MIPI2_CSI_L0_P: BTB Mezzanine (J3.18), MIPI (J10.3 R78.2 R79.1)
MIPI2_CSI_L1_N: BTB Mezzanine (J3.25), MIPI (J10.5 R82.2 R83.2)
MIPI2_CSI_L1_P: BTB Mezzanine (J3.23), MIPI (J10.6 R81.2 R82.1)
MIPI2_GPIO0: BTB Mezzanine (J3.8), MIPI (J10.11)
MIPI2_GPIO1: BTB Mezzanine (J3.7), MIPI (J10.12)
PMOD_1_N: BTB Mezzanine (J2.47), Ethernet & PMOD (R139.1)
PMOD_1_P: BTB Mezzanine (J2.45), Ethernet & PMOD (R137.1)
PMOD_2_N: BTB Mezzanine (J2.57), Ethernet & PMOD (R143.1)
PMOD_2_P: BTB Mezzanine (J2.55), Ethernet & PMOD (R141.1)
PMOD_3_N: BTB Mezzanine (J2.51), Ethernet & PMOD (R140.2)
PMOD_3_P: BTB Mezzanine (J2.49), Ethernet & PMOD (R138.2)
PMOD_4_N: BTB Mezzanine (J2.65), Ethernet & PMOD (R144.2)
PMOD_4_P: BTB Mezzanine (J2.63), Ethernet & PMOD (R142.2)
PMOD_5_N: BTB Mezzanine (J2.69), Ethernet & PMOD (R147.1)
PMOD_5_P: BTB Mezzanine (J2.67), Ethernet & PMOD (R145.1)
PMOD_6_N: BTB Mezzanine (J2.79), Ethernet & PMOD (R151.1)
PMOD_6_P: BTB Mezzanine (J2.77), Ethernet & PMOD (R149.1)
PMOD_7_N: BTB Mezzanine (J2.73), Ethernet & PMOD (R148.2)
PMOD_7_P: BTB Mezzanine (J2.71), Ethernet & PMOD (R146.2)
PMOD_8_N: BTB Mezzanine (J2.85), Ethernet & PMOD (R152.2)
PMOD_8_P: BTB Mezzanine (J2.83), Ethernet & PMOD (R150.2)
PMOD_9_N: BTB Mezzanine (J3.49), Ethernet & PMOD (R159.1)
PMOD_9_P: BTB Mezzanine (J3.47), Ethernet & PMOD (R157.1)
PMOD_10_N: BTB Mezzanine (J3.59), Ethernet & PMOD (R163.1)
PMOD_10_P: BTB Mezzanine (J3.57), Ethernet & PMOD (R161.1)
PMOD_11_N: BTB Mezzanine (J3.55), Ethernet & PMOD (R160.2)
PMOD_11_P: BTB Mezzanine (J3.53), Ethernet & PMOD (R158.2)
PMOD_12_N: BTB Mezzanine (J3.63), Ethernet & PMOD (R164.2)
PMOD_12_P: BTB Mezzanine (J3.61), Ethernet & PMOD (R162.2)
PMOD_13S: BTB Mezzanine (J3.58), Ethernet & PMOD (R165.1)
PMOD_14S: BTB Mezzanine (J3.62), Ethernet & PMOD (R167.1)
PMOD_15S: BTB Mezzanine (J3.89), Ethernet & PMOD (R169.1)
PMOD_16S: BTB Mezzanine (J3.99), Ethernet & PMOD (R171.1)
PMOD_17S: BTB Mezzanine (J3.60), Ethernet & PMOD (R166.2)
PMOD_18S: BTB Mezzanine (J3.64), Ethernet & PMOD (R168.2)
PMOD_19S: BTB Mezzanine (J3.93), Ethernet & PMOD (R170.2)
PMOD_20S: BTB Mezzanine (J3.84), Ethernet & PMOD (R172.2)
PS_500_nRESET_OUT: BTB Mezzanine (J2.133), SD & Boot (U4.1 U4.5)
PS_nRESET_eMMC: BTB Mezzanine (J2.137), SD & Boot (U5.4)
PS_nWARMRESET_IN: BTB Mezzanine (J2.135), SD & Boot (C17.2 D13.1 S2.2)
RGMII_LED_ACT: BTB Mezzanine (J2.26), Ethernet & PMOD (U17.1)
RGMII_LED_LINK: BTB Mezzanine (J2.28), Ethernet & PMOD (U17.3)
RGMII_TR0_N: BTB Mezzanine (J2.9), Ethernet & PMOD (J20.3)
RGMII_TR0_P: BTB Mezzanine (J2.7), Ethernet & PMOD (J20.2)
RGMII_TR1_N: BTB Mezzanine (J2.12), Ethernet & PMOD (J20.7)
RGMII_TR1_P: BTB Mezzanine (J2.10), Ethernet & PMOD (J20.4)
RGMII_TR2_N: BTB Mezzanine (J2.15), Ethernet & PMOD (J20.6)
RGMII_TR2_P: BTB Mezzanine (J2.13), Ethernet & PMOD (J20.5)
RGMII_TR3_N: BTB Mezzanine (J2.18), Ethernet & PMOD (J20.9)
RGMII_TR3_P: BTB Mezzanine (J2.16), Ethernet & PMOD (J20.8)
SDIO_CD: BTB Mezzanine (J2.116), SD & Boot (J4.CD1 R18.1)
SDIO_CLK: BTB Mezzanine (J2.104), SD & Boot (U3.9)
SDIO_CMD: BTB Mezzanine (J2.106), SD & Boot (U3.4)
SDIO_D1: BTB Mezzanine (J2.108), SD & Boot (U3.6)
SDIO_D2: BTB Mezzanine (J2.110), SD & Boot (U3.7)
SDIO_D3: BTB Mezzanine (J2.112), SD & Boot (U3.1)
SDIO_D4: BTB Mezzanine (J2.114), SD & Boot (U3.3)
SDIO_WP: BTB Mezzanine (J2.118), SD & Boot (C14.2 D12.1 R25.1 S1.2)
Sys_PG: BTB Mezzanine (J2.131), Power (R6.1)
TCK: BTB Mezzanine (J2.94), FTDI (D18.1 J6.6 R29.2 R36.2)
TDI_USB/TDO_FPGA: BTB Mezzanine (J2.100), FTDI (D19.1 J6.8 R30.2 R38.2)
TDO_USB/TDI_FPGA: BTB Mezzanine (J2.98), FTDI (D20.1 J6.10 R31.2 R37.2)
TMS: BTB Mezzanine (J2.96), FTDI (D17.1 J6.4 R28.2 R39.2)
UART_RX_FPGA: BTB Mezzanine (J2.115), FTDI (R33.1 R47.2)
UART_TX_FPGA: BTB Mezzanine (J2.113), FTDI (R34.1 R49.2)
USB_HUB1_N: FTDI (U7.4), USB (U14.8)
USB_HUB1_P: FTDI (U7.3), USB (U14.9)
USB_PHY_ID: BTB Mezzanine (J2.25), USB (R118.1)
USB_PHY_N: BTB Mezzanine (J2.21), USB (R116.1)
USB_PHY_P: BTB Mezzanine (J2.19), USB (R117.1)
USB_PHY_VBUS: BTB Mezzanine (J2.27), USB (R115.1)
VBUS1: FTDI (J8.VBUS R56.1), USB (U15.8)
XADC_IN_N: BTB Mezzanine (J2.97), Ethernet & PMOD (R133.1)
XADC_IN_P: BTB Mezzanine (J2.95), Ethernet & PMOD (R131.1)
XADC_TEMP_N: BTB Mezzanine (J2.101), Ethernet & PMOD (R134.2)
XADC_TEMP_P: BTB Mezzanine (J2.99), Ethernet & PMOD (R132.2)